# EasyEDA Pro project ProProject_AT_START_M412_V1.0.epro, schematic AT-START-M412-V1.0

## Sheets
1 AT-Link-EZ-V1.4: Board Name: AT-START-M412-V1.0; Create Date: 2024-06-20; Page Name: AT-Link-EZ-V1.4; Project Name: AT-START-M412; Schematic Name: AT-START-M412-V1.0; Update Date: 2024-08-05
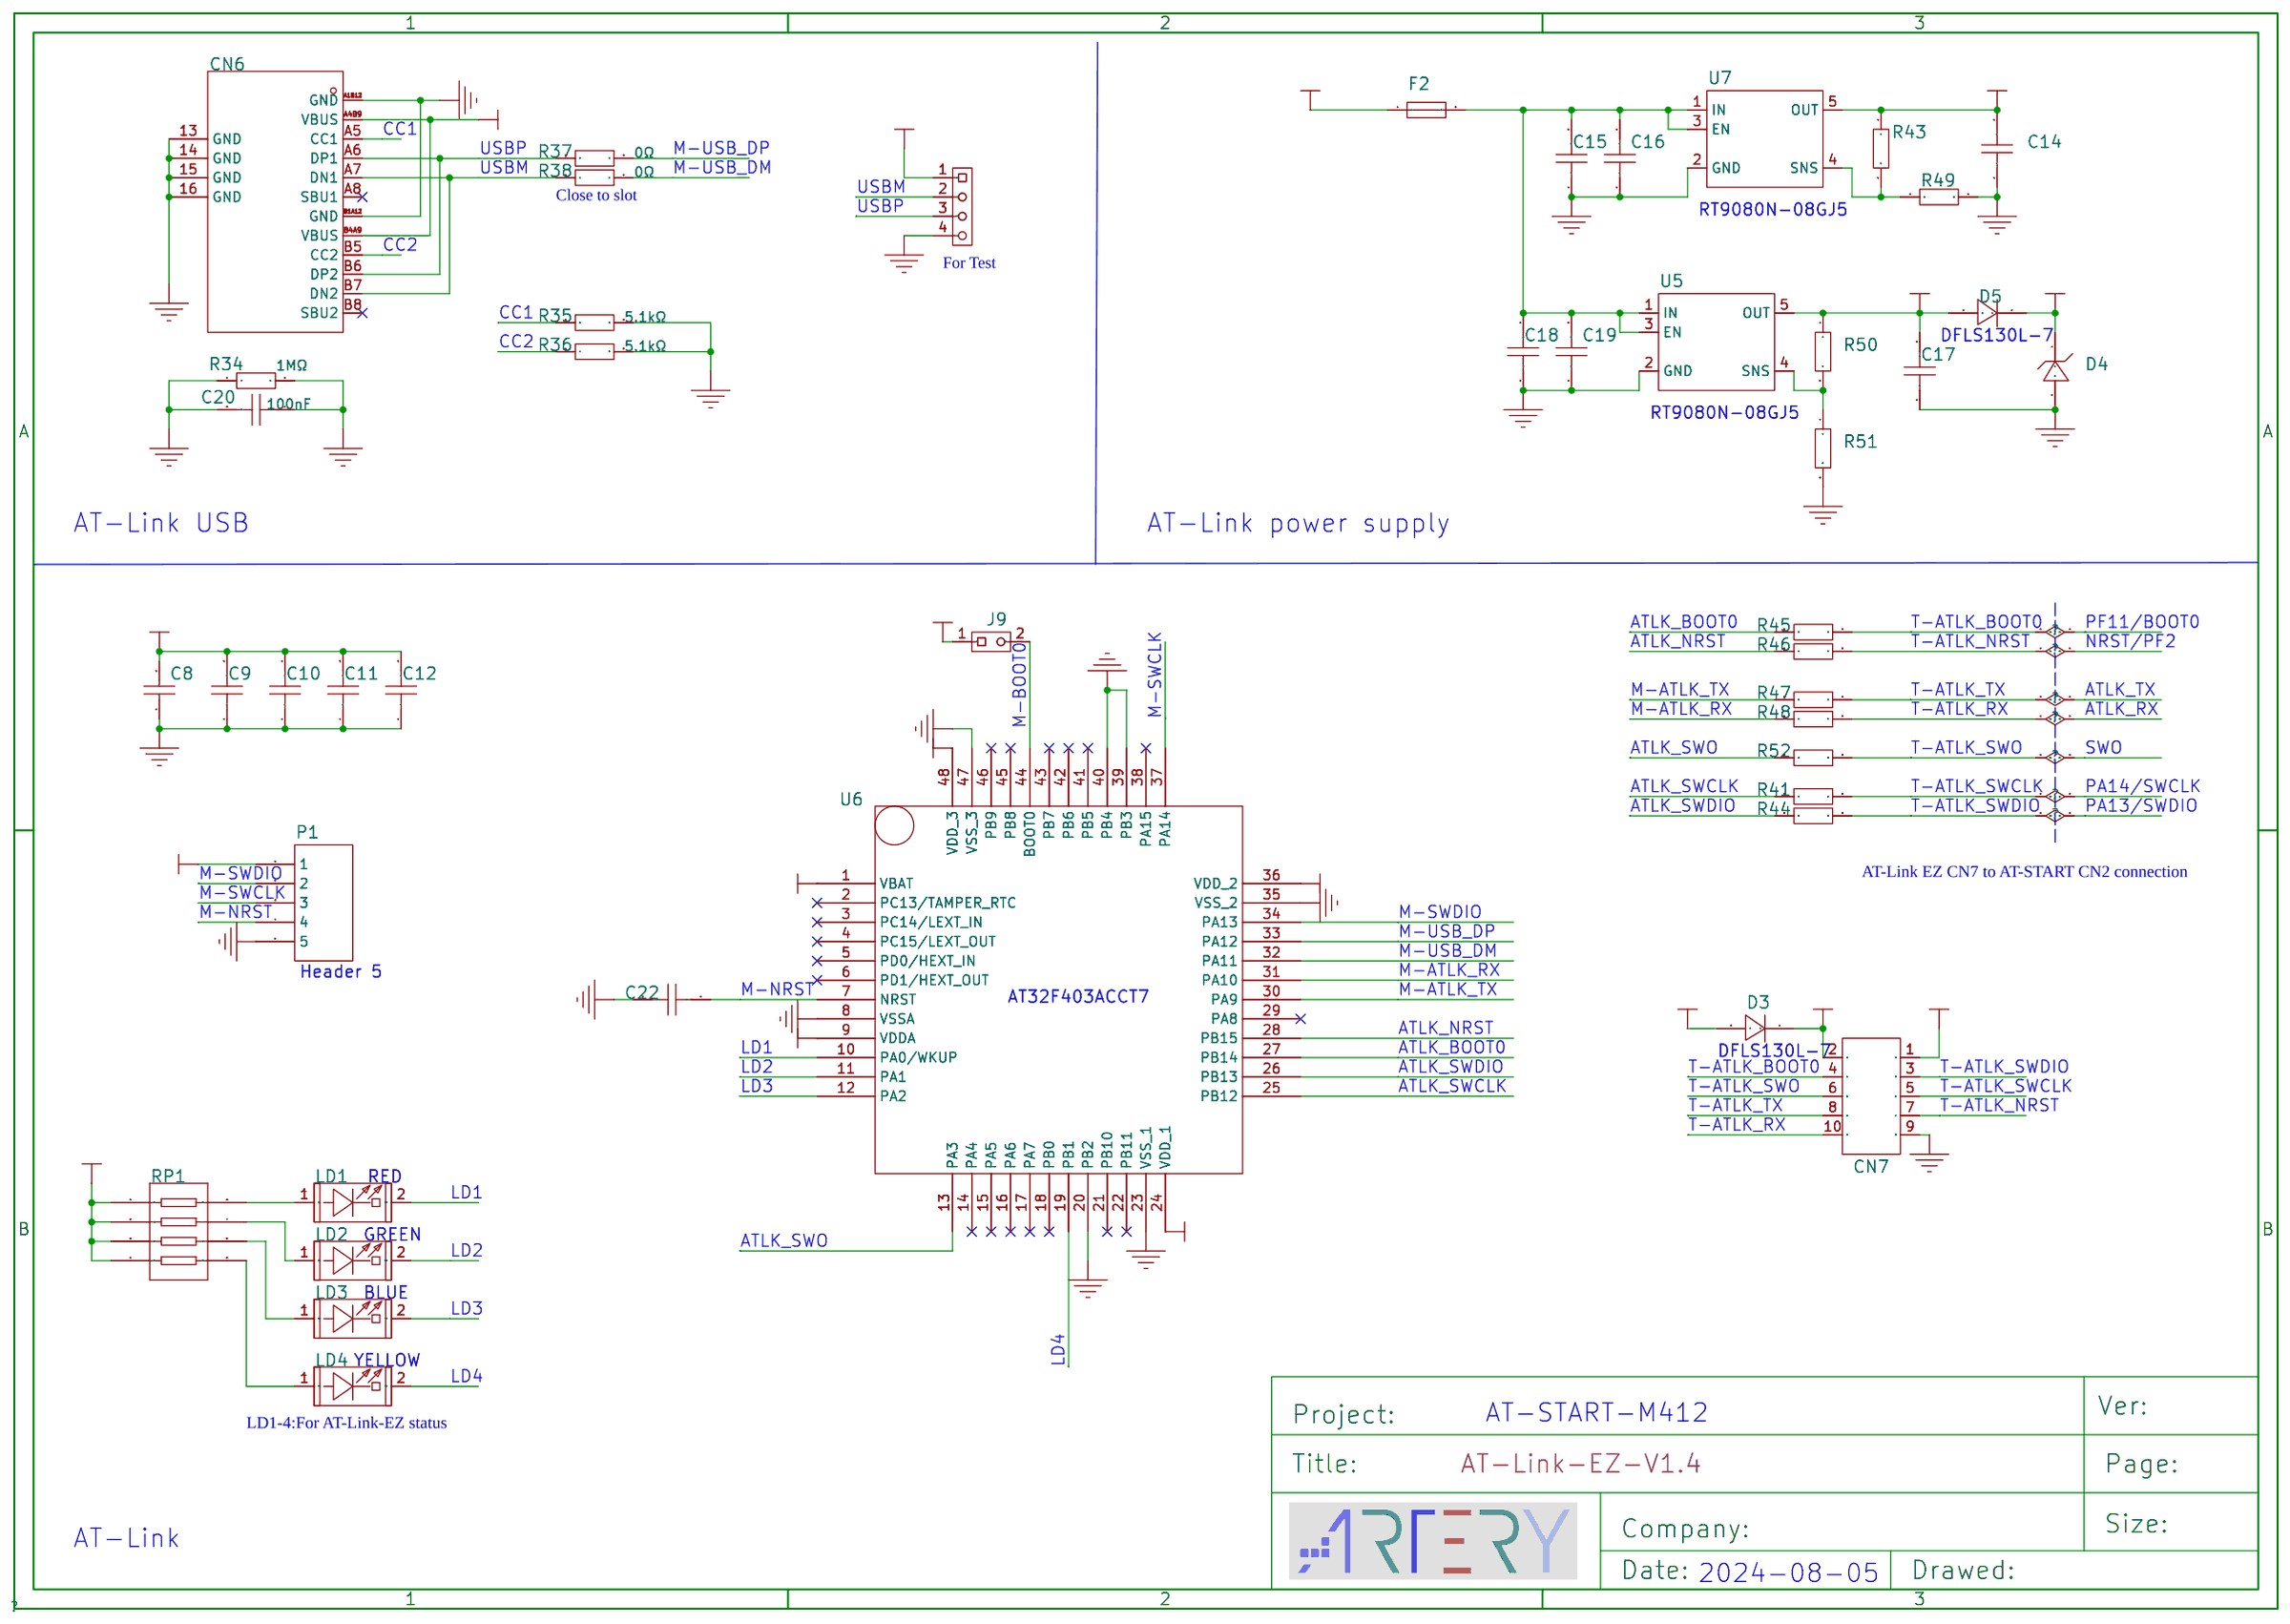
[diagram p0: AT-Link-EZ-V1.4]
2 MCU: Page Name: MCU; Update Date: 2024-08-06
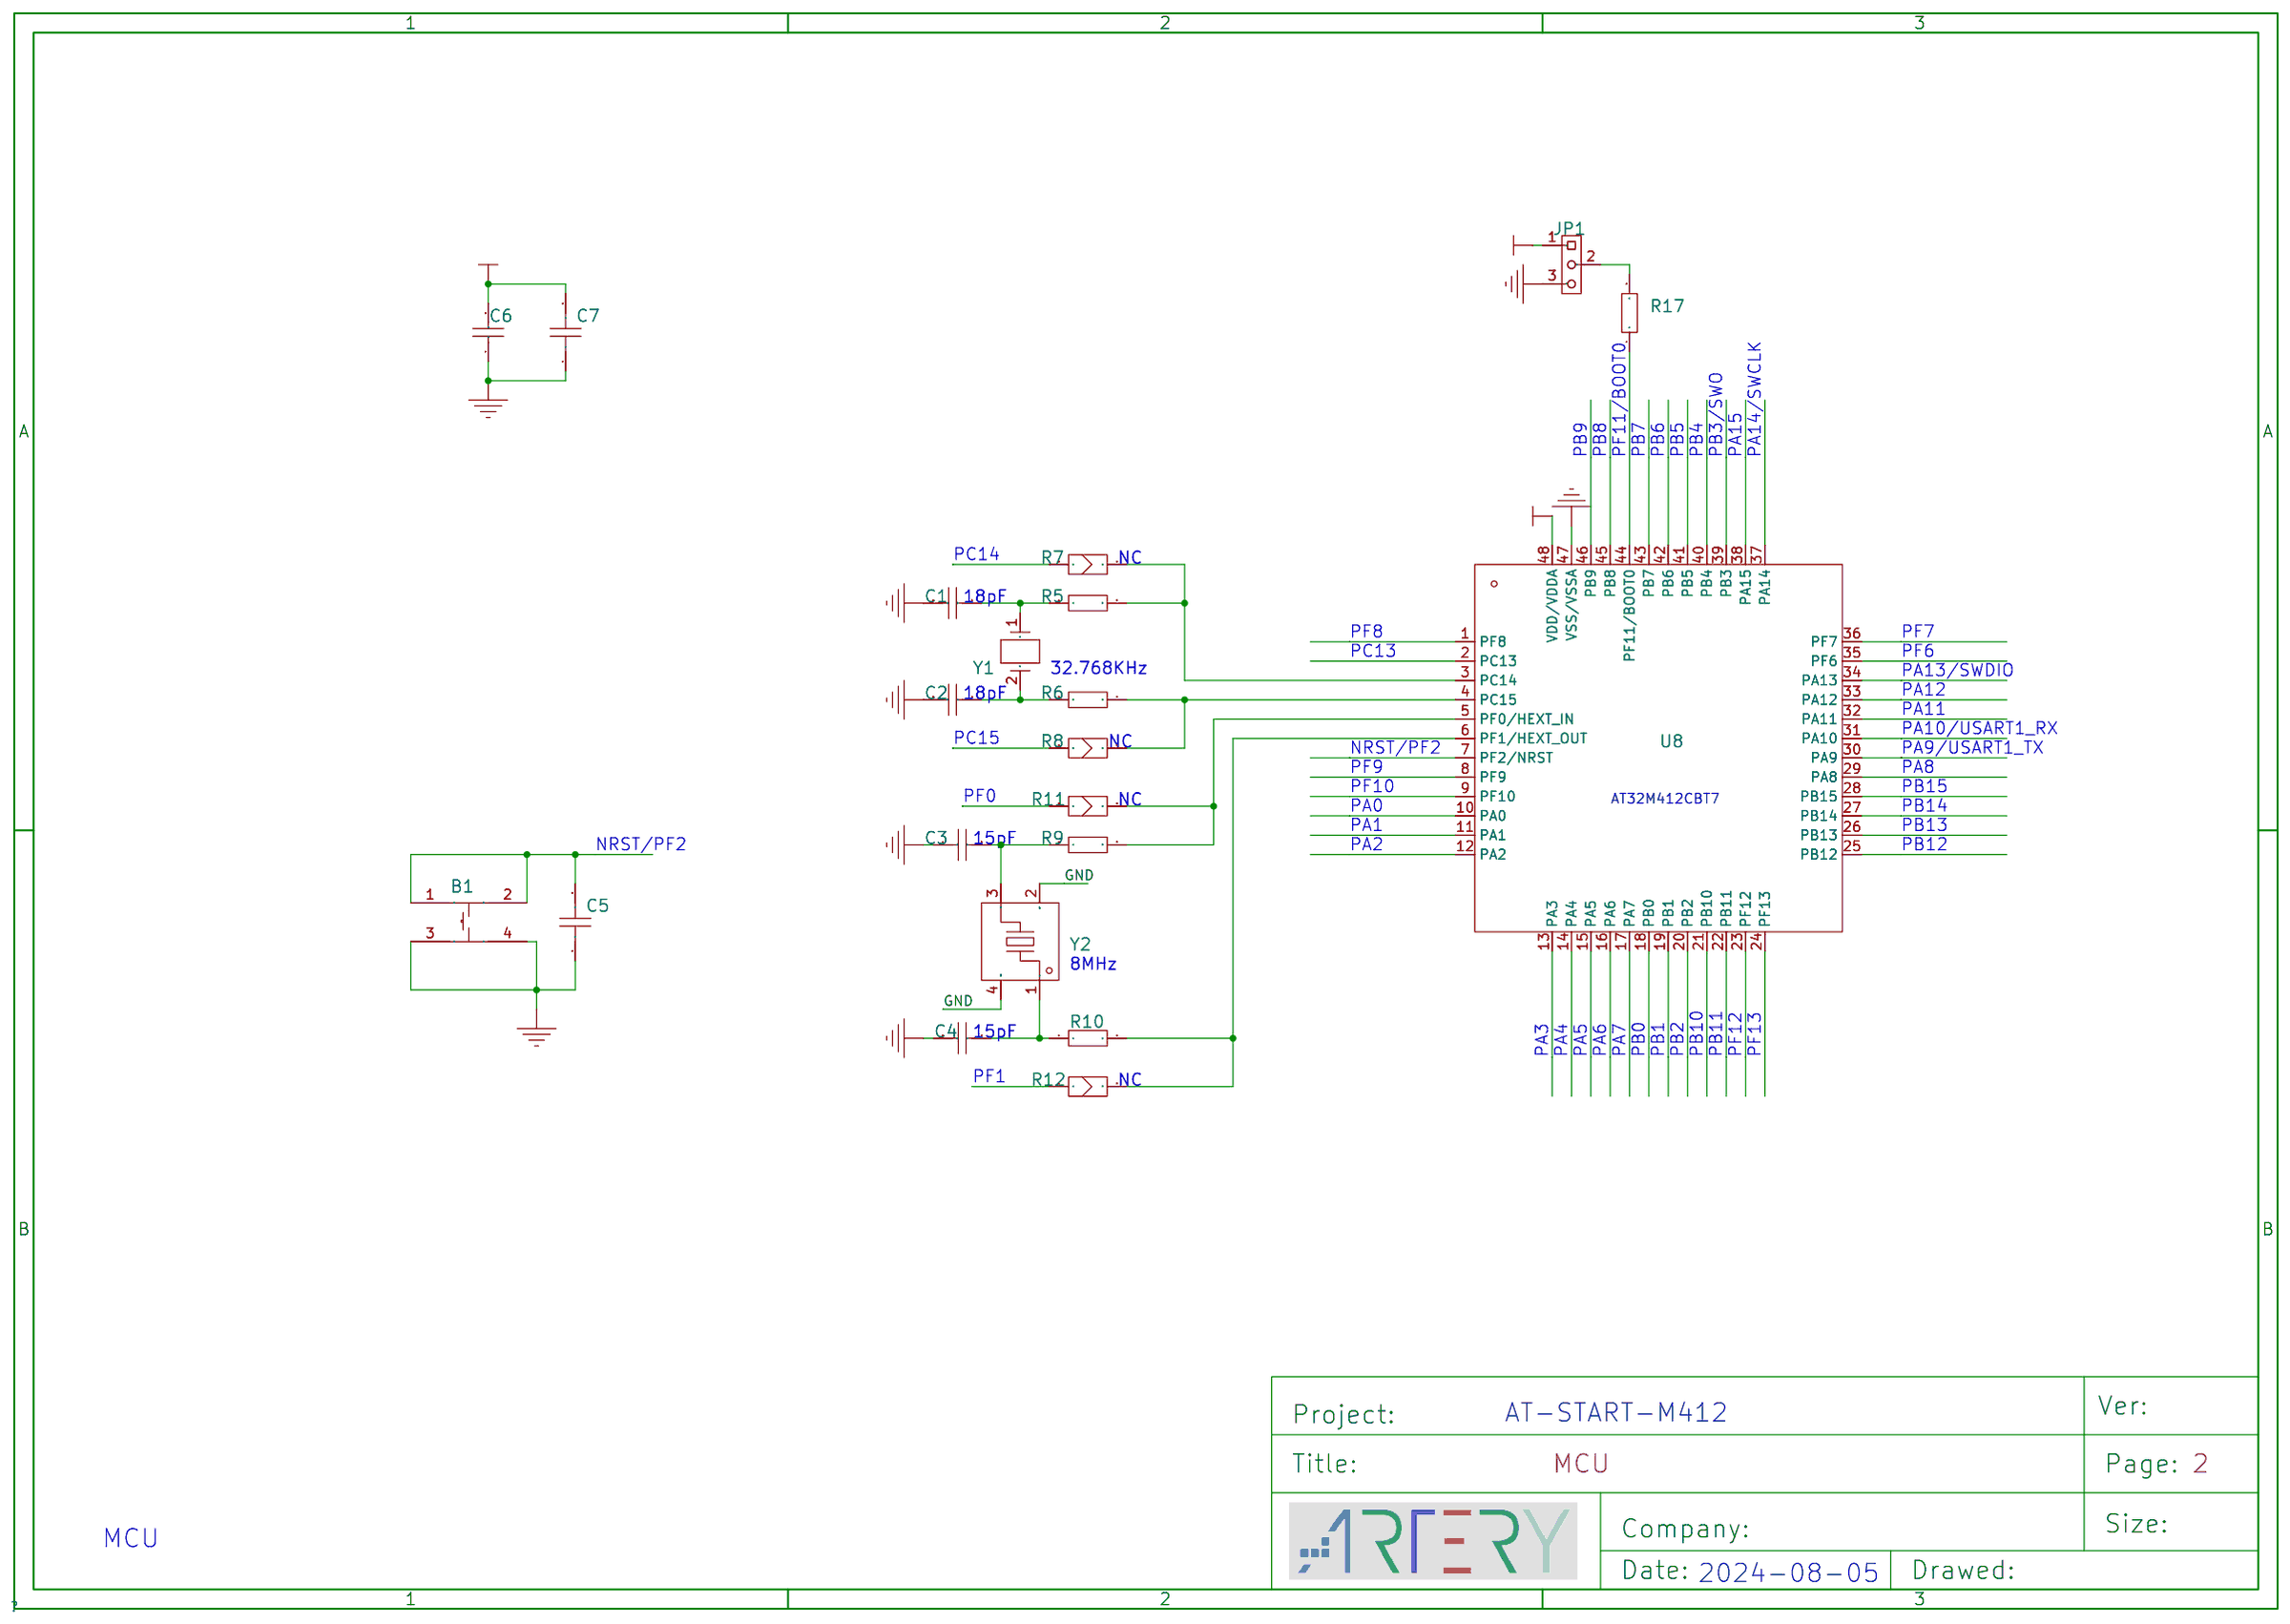
[diagram p1: MCU]
3 Power &amp; Peripherals: Page Name: Power &amp; Peripherals; Update Date: 2024-09-05
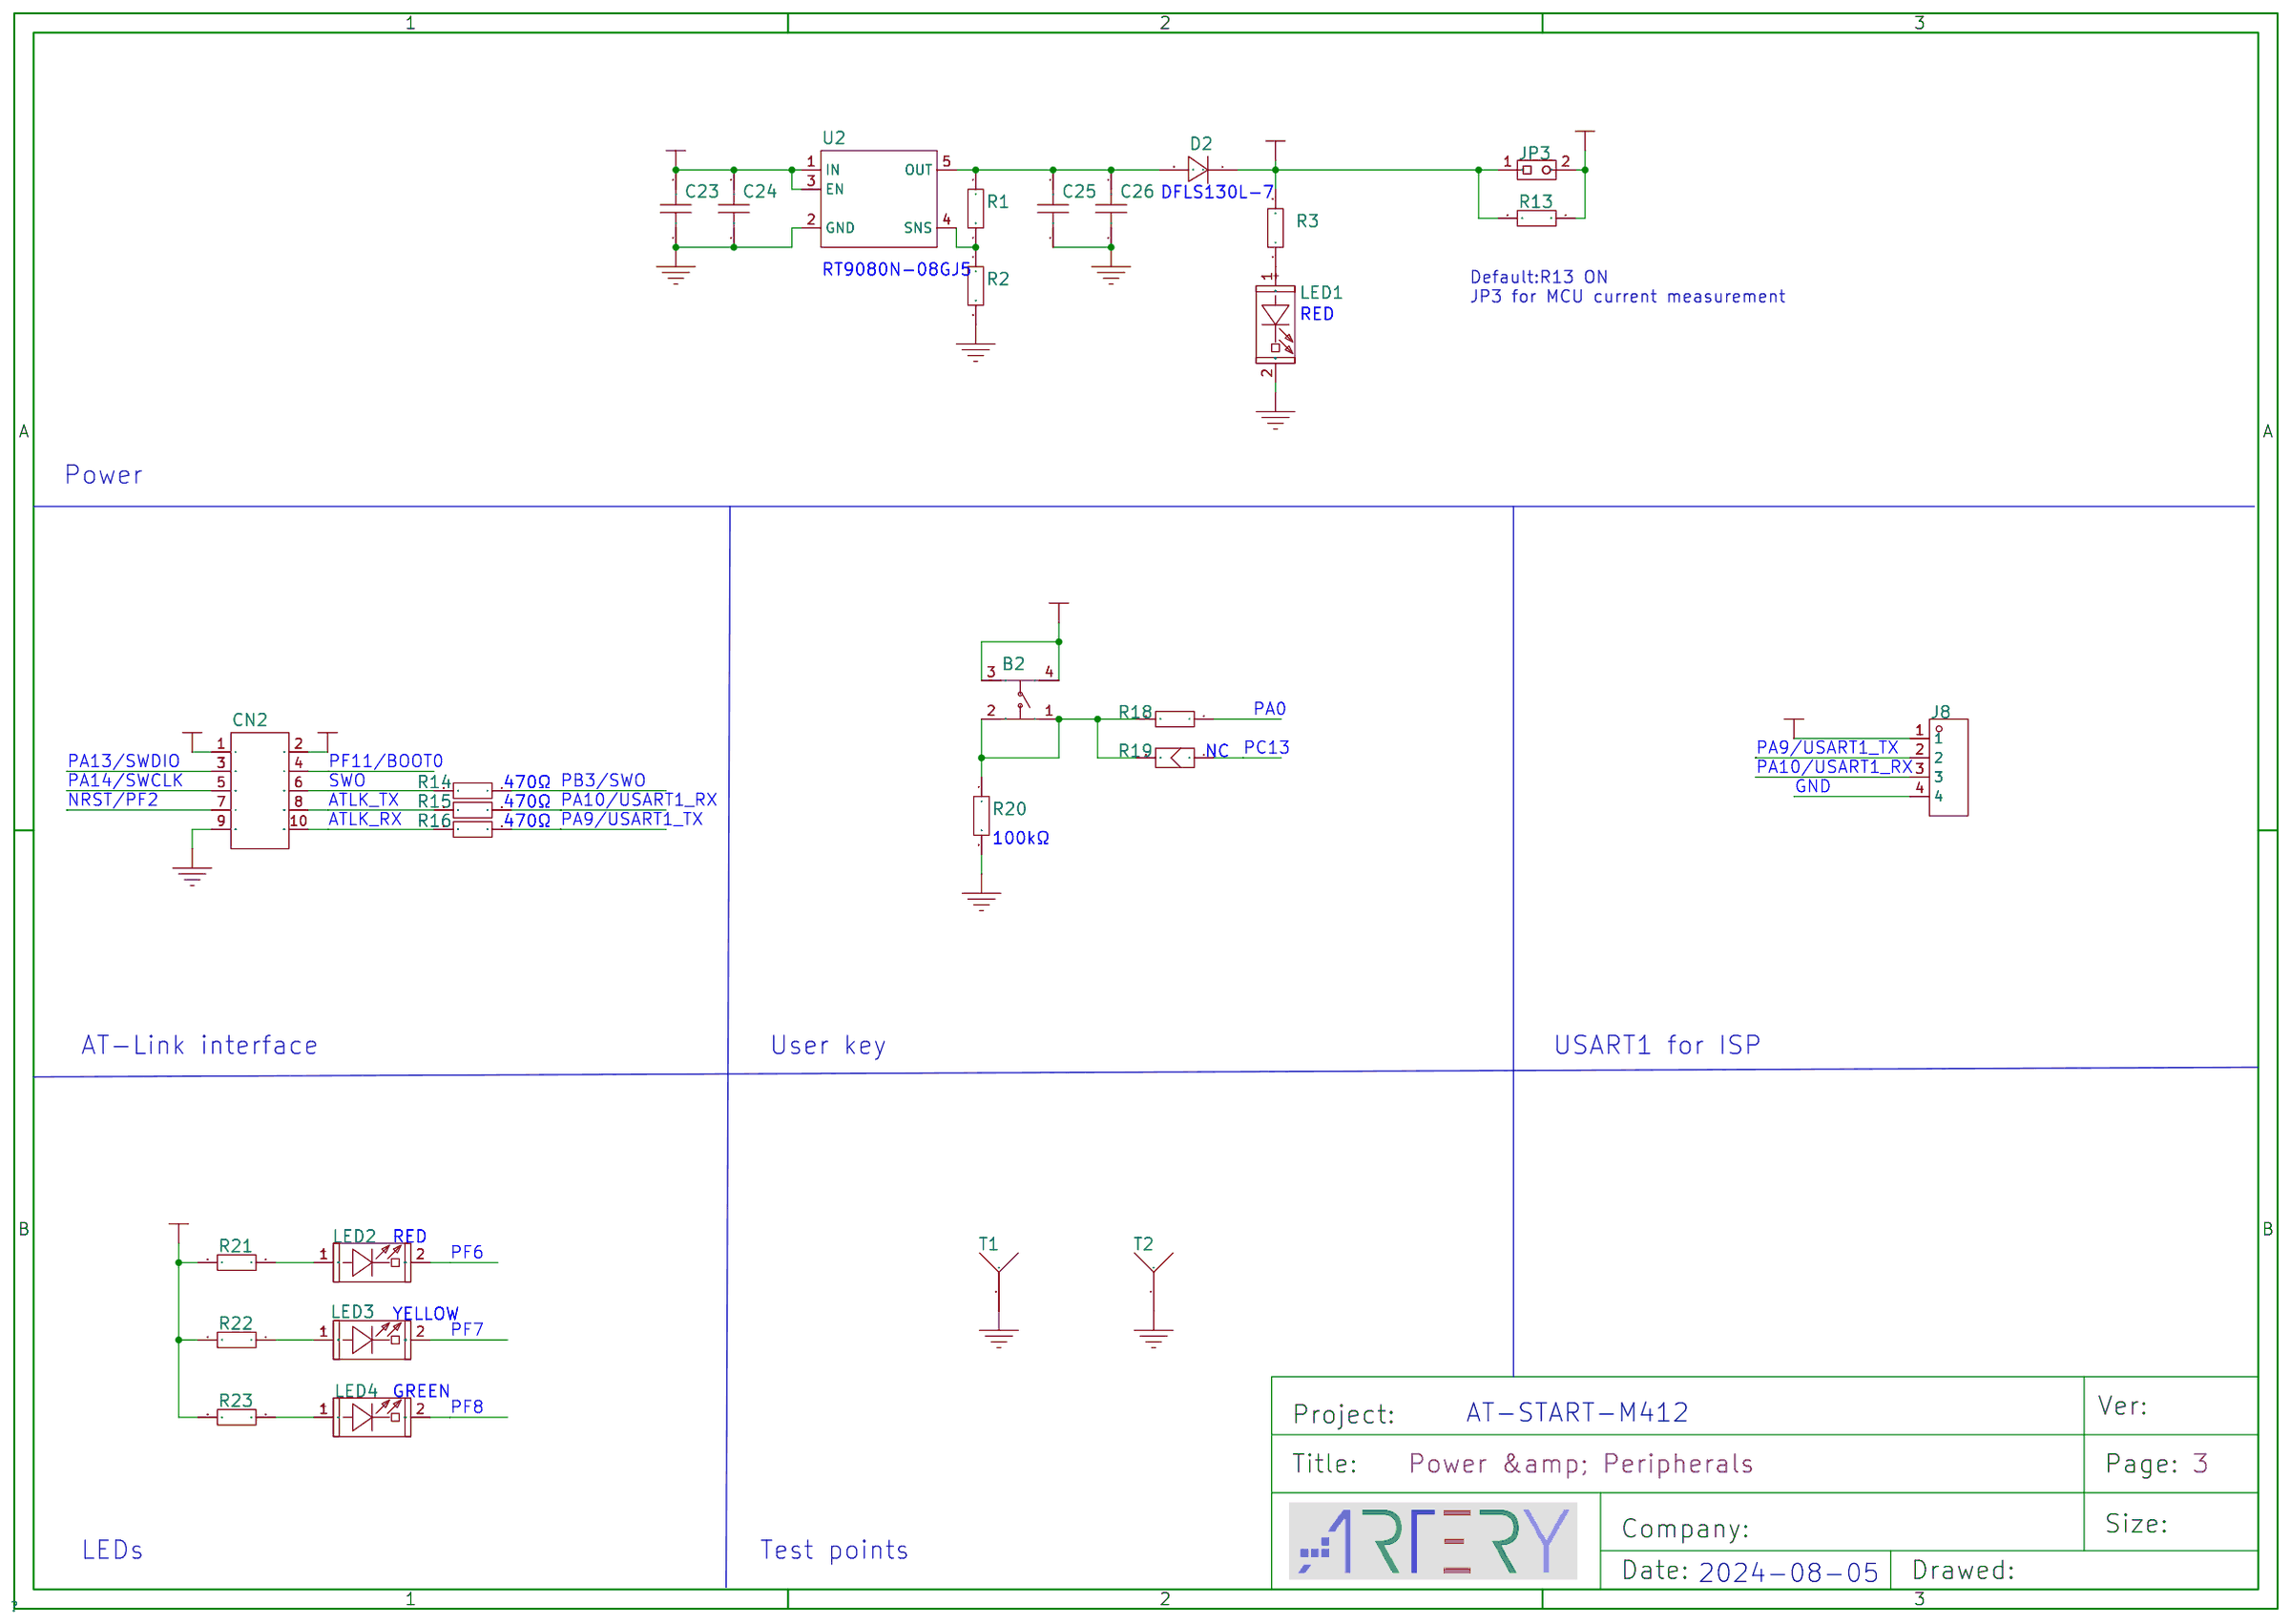
[diagram p2: Power &amp; Peripherals]
4 Connectors: Page Name: Connectors; Update Date: 2024-09-05
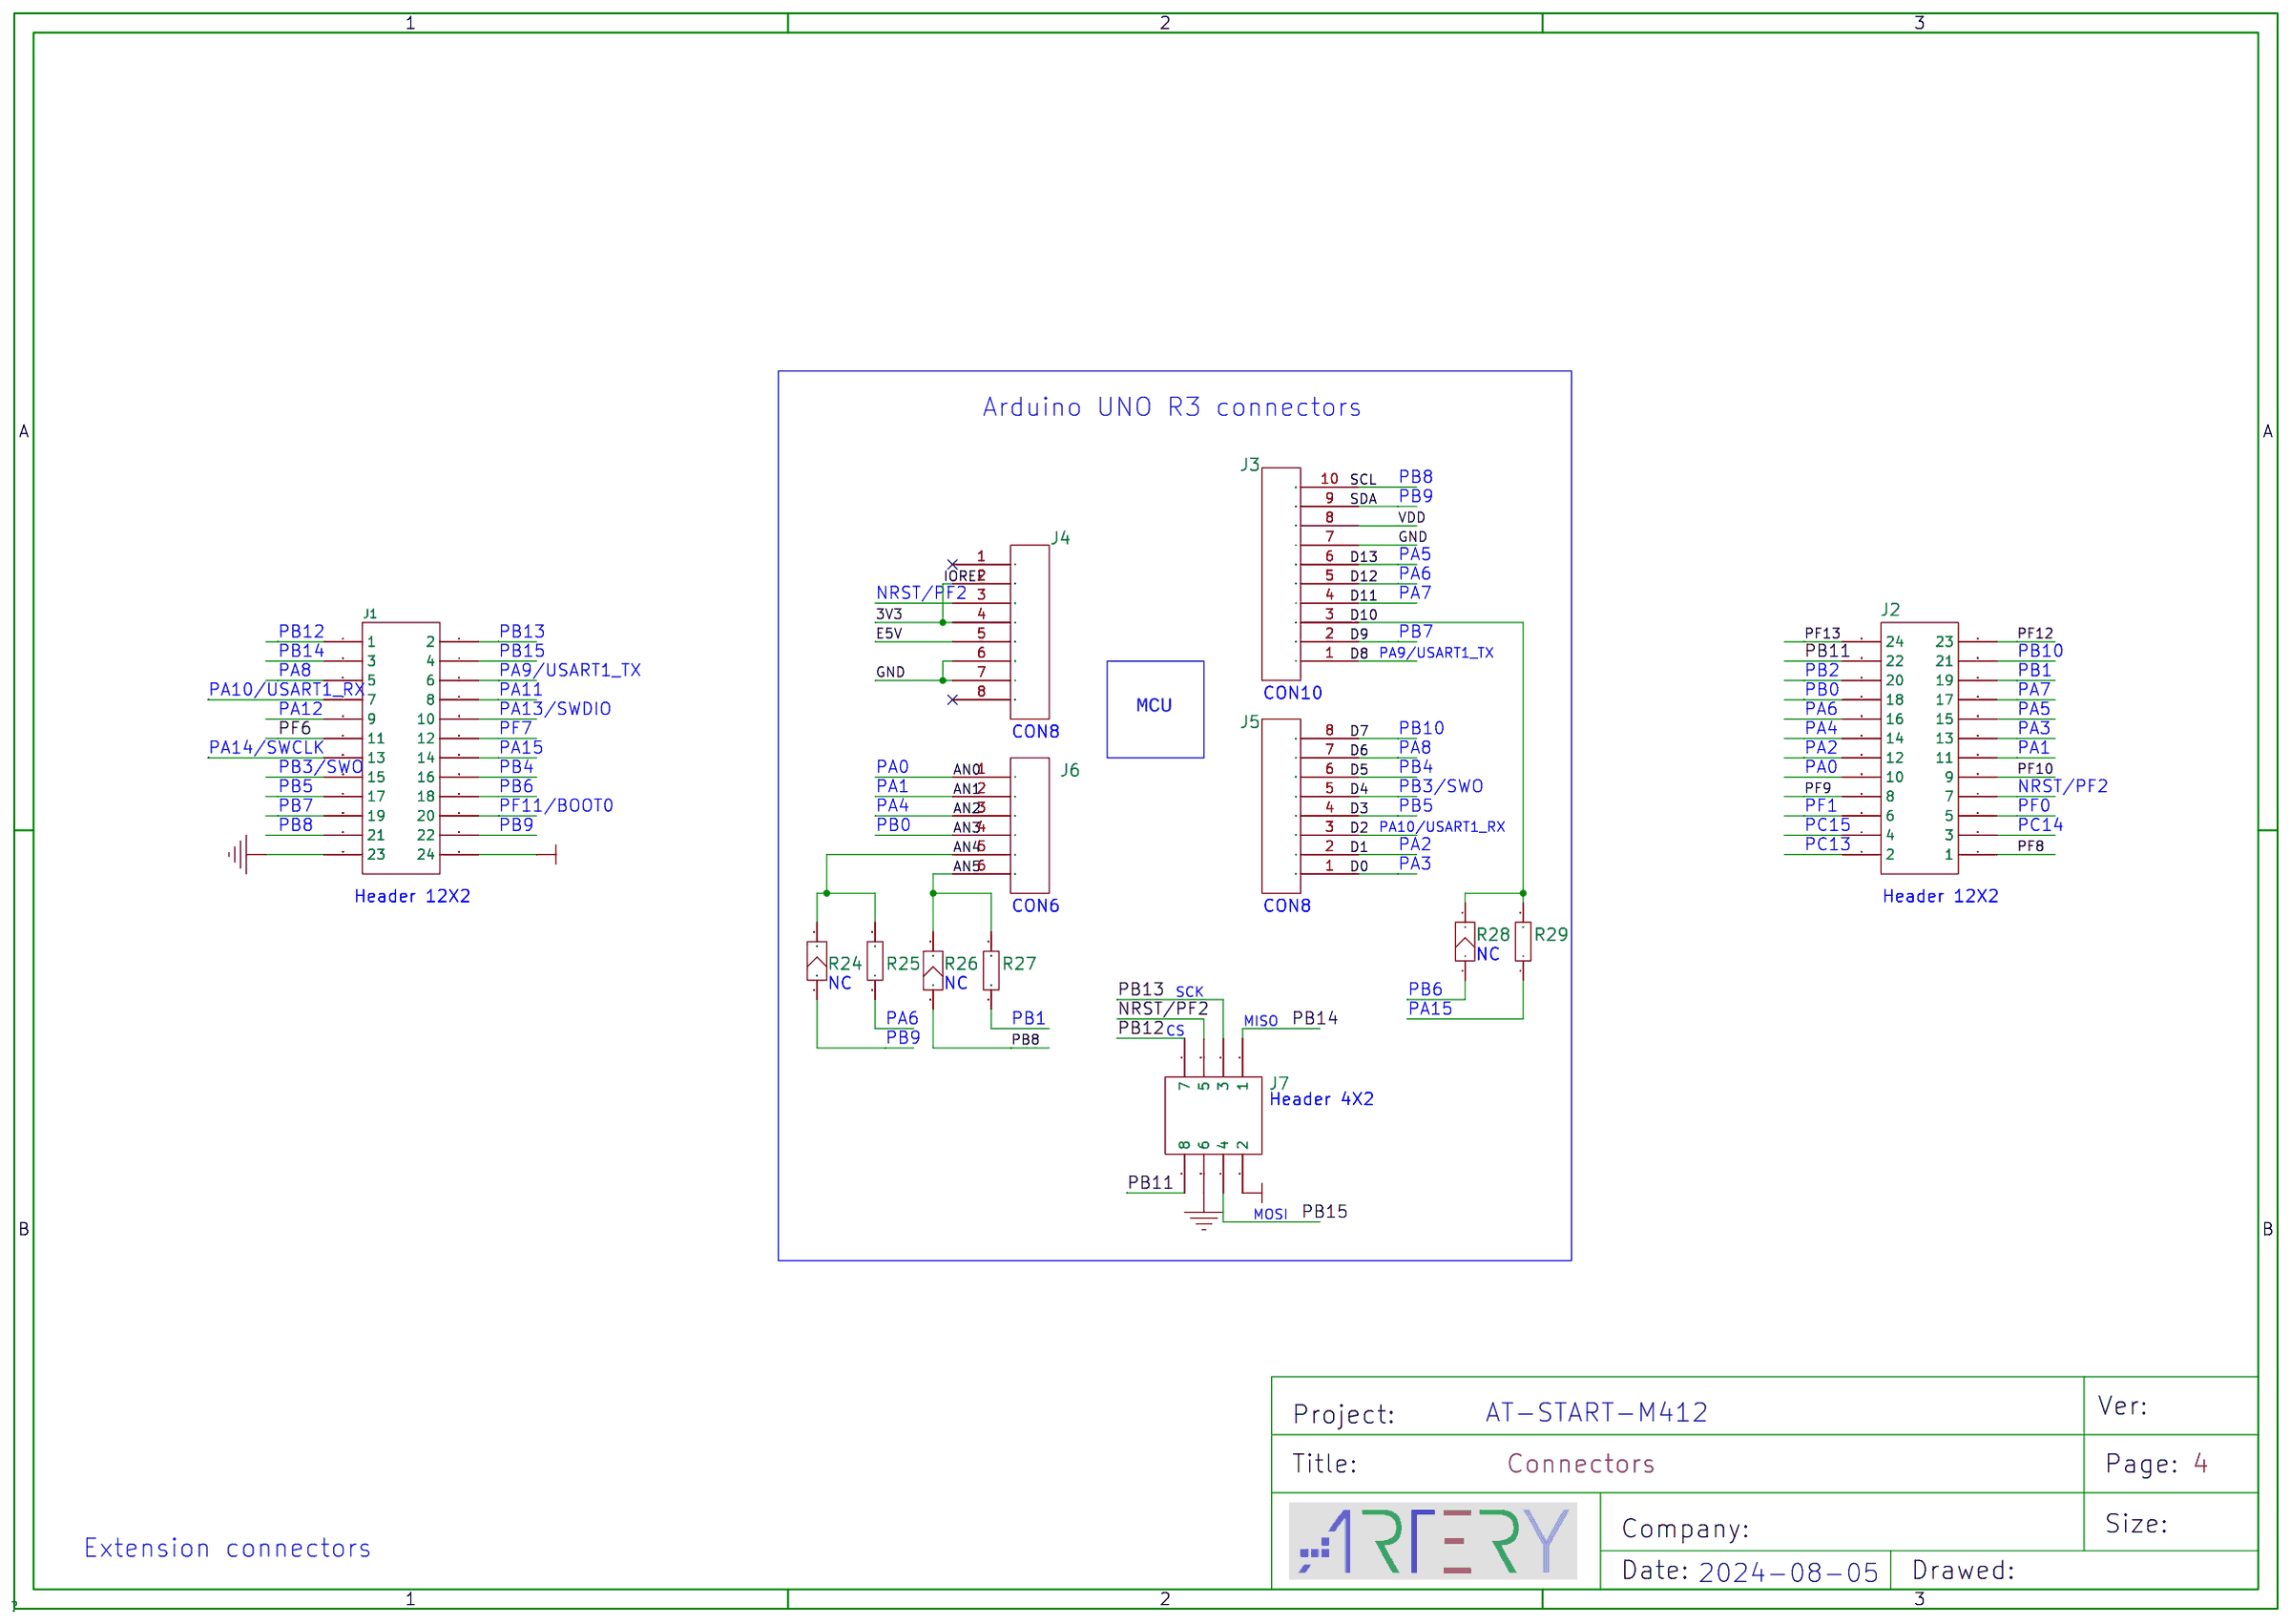
[diagram p3: Connectors]

## Parts
sheet AT-Link-EZ-V1.4
C8  4.7uF  [C0603]
C9  100nF  [C0603]
C10  100nF  [C0603]
C11  100nF  [C0603]
C12  100nF  [C0603]
C14  10uF  [C0603]
C15  10uF  [C0603]
C16  100nF  [C0603]
C17  10uF  [C0603]
C18  10uF  [C0603]
C19  100nF  [C0603]
C20  100nF  [C0603]
C22  100nF  [C0603]
CN6  -  [USB-C-SMD_TYPEC-304-BCP16]
CN7  CON10  [HDR2X5]
D3  DFLS130L-7  [POWERDI-123_L2.8-W1.8-LS3.7-RD]
D4  SMF3.3A  [SOD-123FL_L2.8-W1.8-LS3.8-RD]
D5  DFLS130L-7  [POWERDI-123_L2.8-W1.8-LS3.7-RD]
F2  BSMD0603-050-6V  [F0603]
J9  1X2P_2.54M  [HDR1X2]
LD1  RED  [LED0603]
LD2  GREEN  [LED0603]
LD3  BLUE  [LED0603]
LD4  YELLOW  [LED0603]
P1  Header 5  [HDR1X5]
R34  1MΩ  [R0603]
R35  5.1kΩ  [R0603]
R36  5.1kΩ  [R0603]
R37  0Ω  [R0603]
R38  0Ω  [R0603]
R41  33Ω  [R0603]
R43  47kΩ  [R0603]
R44  33Ω  [R0603]
R45  33Ω  [R0603]
R46  33Ω  [R0603]
R47  33Ω  [R0603]
R48  33Ω  [R0603]
R49  15kΩ  [R0603]
R50  51kΩ  [R0603]
R51  15kΩ  [R0603]
R52  33Ω  [R0603]
RP1  1kΩ  [RES-ARRAY-SMD_0603-8P-L3.2-W1.6-BL]
TP3  1X4P_2.54F  [HDR1X4 - TOP]
U5  RT9080N-08GJ5  [SOT-23-5]
U6  AT32F403ACCT7  [LQFP48 - 2]
U7  RT9080N-08GJ5  [SOT-23-5]
sheet Connectors
J1  Header 12X2  [HEAD2*12]
J2  Header 12X2  [HEAD2*12]
J3  CON10  [HDR1X10 - 2#]
J4  CON8  [HDR1X8 - 2#]
J5  CON8  [HDR1X8 - 2#]
J6  CON6  [HDR1X6 -2#]
J7  Header 4X2  [HDR2X4]
R24  NC  [SB-PAD_2]
R25  0Ω  [SB-PAD_2]
R26  NC  [SB-PAD_2]
R27  0Ω  [SB-PAD_2]
R28  NC  [SB-PAD_2]
R29  0Ω  [SB-PAD_2]
sheet MCU
B1  TS-1002S-05026C  [KEY-SMD_4P-L6.0-W6.0-P4.50-LS9.0]
C1  18pF  [C0603]
C2  18pF  [C0603]
C3  15pF  [C0603]
C4  15pF  [C0603]
C5  100nF  [C0603]
C6  4.7uF  [C0603]
C7  100nF  [C0603]
JP1  2.54-1*3P针  [HDR-TH_3P-P2.54-V-M-1]
R5  0Ω  [SB-PAD_2]
R6  0Ω  [SB-PAD_2]
R7  NC  [SB-PAD_2]
R8  NC  [SB-PAD_2]
R9  0Ω  [SB-PAD_2]
R10  0Ω  [SB-PAD_2]
R11  NC  [SB-PAD_2]
R12  NC  [SB-PAD_2]
R17  3.3kΩ  [R0603]
U8  -  [LQFP-48_L7.0-W7.0-P0.50-LS9.0-BL]
Y1  32.768KHz  [XTAL_SOP - FC-12M]
Y2  8MHz  [CRYSTAL-SMD_4P-L3.2-W2.5-BL]
sheet Power &amp; Peripherals
B2  TSA063G60-250  [KEY-SMD_4P-L6.1-W6.1-P4.50-LS9.0]
C23  10uF  [C0603]
C24  100nF  [C0603]
C25  10uF  [C0603]
C26  100nF  [C0603]
CN2  CON10  [HDR2X5]
D2  DFLS130L-7  [POWERDI-123_L2.8-W1.8-LS3.7-RD]
J8  PZ2.54-1*4-WZ  [HDR-TH_4P-P2.54-H-M-W7.7-P]
JP3  1X2P_2.54M  [HDR1X2]
LED1  RED  [LED0603]
LED2  RED  [LED0603]
LED3  YELLOW  [LED0603]
LED4  GREEN  [LED0603]
R1  51kΩ  [R0603]
R2  15kΩ  [R0603]
R3  1kΩ  [R0603]
R13  0Ω  [SB-PAD_2]
R14  470Ω  [R0603]
R15  470Ω  [R0603]
R16  470Ω  [R0603]
R18  0Ω  [SB-PAD_2]
R19  NC  [SB-PAD_2]
R20  100kΩ  [R0603]
R21  1kΩ  [R0603]
R22  1kΩ  [R0603]
R23  1kΩ  [R0603]
T1  Test point  [TestPoint]
T2  Test point  [TestPoint]
U2  RT9080N-08GJ5  [SOT-23-5]

## Library data of the parts
C8 = CL10A475KO8NNNC: 容值:4.7uF;精度:±10%;额定电压:16V;材质(温度系数):X5R;; LCSC Part Name: 4.7uF ±10% 16V; Supplier Part: C19666; Manufacturer: SAMSUNG(三星); Supplier Footprint: 0603; JLCPCB Part Class: Basic Part; Datasheet: https://atta.szlcsc.com/upload/public/pdf/source/20160218/1457707763339.pdf; Supplier: LCSC; Tolerance: ±10%; Voltage Rated: 16V; Temperature Coefficient: X5R; Design Item ID: Cap Semi; Library Name: PcbLib; Published: 8-Jun-2000; LatestRevisionDate: 29-May-2009; LatestRevisionNote: IPC-7351 Footprint Added.; PackageReference: C1206; Publisher: Altium Limited; PackageDescription: Chip Capacitor; Origin Footprint 2: 0603; Origin Footprint 3: 0402; Origin Footprint 4: C2512; Origin Footprint 5: 1608[0603]; Origin Footprint 6: C1210
C9-C12 = CC0603KRX7R9BB104: 容值:100nF;精度:±10%;额定电压:50V;材质(温度系数):X7R;; LCSC Part Name: 100nF ±10% 50V; Supplier Part: C14663; Manufacturer: YAGEO(国巨); Supplier Footprint: 0603; JLCPCB Part Class: Basic Part; Datasheet: https://atta.szlcsc.com/upload/public/pdf/source/20180910/C282072_33301C7F631E79921B82A8DAC6BCC5B3.pdf; Supplier: LCSC; Tolerance: ±10%; Voltage Rated: 50V; Temperature Coefficient: X7R; Design Item ID: Cap Semi; Library Name: PcbLib; Published: 8-Jun-2000; LatestRevisionDate: 29-May-2009; LatestRevisionNote: IPC-7351 Footprint Added.; PackageReference: C1206; Publisher: Altium Limited; PackageDescription: Chip Capacitor; Origin Footprint 2: 0603; Origin Footprint 3: 0402; Origin Footprint 4: C2512; Origin Footprint 5: 1608[0603]; Origin Footprint 6: C1210
C14 C15 C17 C18 = CL10A106KP8NNNC: 容值:10uF;精度:±10%;额定电压:10V;材质(温度系数):X5R;; LCSC Part Name: 10uF ±10% 10V; Supplier Part: C19702; Manufacturer: SAMSUNG(三星); Supplier Footprint: 0603; JLCPCB Part Class: Basic Part; Datasheet: https://atta.szlcsc.com/upload/public/pdf/source/20160218/1457707763339.pdf; Supplier: LCSC; Tolerance: ±10%; Voltage Rated: 10V; Temperature Coefficient: X5R; Design Item ID: 0.1uF,50V,20%,SMD0603; Library Name: *
C5 C16 C19 C22 = CC0603KRX7R9BB104: 容值:100nF;精度:±10%;额定电压:50V;材质(温度系数):X7R;; LCSC Part Name: 100nF ±10% 50V; Supplier Part: C14663; Manufacturer: YAGEO(国巨); Supplier Footprint: 0603; JLCPCB Part Class: Basic Part; Datasheet: https://atta.szlcsc.com/upload/public/pdf/source/20180910/C282072_33301C7F631E79921B82A8DAC6BCC5B3.pdf; Supplier: LCSC; Tolerance: ±10%; Voltage Rated: 50V; Temperature Coefficient: X7R; Design Item ID: 0.1uF,50V,20%,SMD0603; Library Name: *
C20 = CC0603KRX7R9BB104: 容值:100nF;精度:±10%;额定电压:50V;温度系数:X7R;; LCSC Part Name: 100nF ±10% 50V; Supplier Part: C14663; Manufacturer: YAGEO(国巨); Supplier Footprint: 0603; JLCPCB Part Class: Basic Part; Datasheet: https://atta.szlcsc.com/upload/public/pdf/source/20170116/1484561234239.pdf; Supplier: LCSC; Tolerance: ±10%; Voltage Rated: 50V; Temperature Coefficient: X7R
CN6 = TYPEC-304-BCP16: 连接器类型:Type-C;标准:USB 3.1;公母:母座;触点数量:16.0;端口数量:1;安装方式:卧贴;额定电流 - 电源:3A;工作温度范围:-25~+85;焊接温度(最大值):260;; Supplier Part: C720629; Manufacturer: XUNPU(讯普); Supplier Footprint: SMD; JLCPCB Part Class: Extended Part; Datasheet: https://atta.szlcsc.com/upload/public/pdf/source/20211022/DACD6552F639E9483017DE6DC0E61150.pdf; Supplier: LCSC; Connector Type: Type-C; Standard: USB 3.1; Gender: 母座; Number of Contacts: 16.0; Number of Ports: 1; Mounting Sytle: 卧贴; Current Rating - Power (Max): 3A; Operating Temperature Range: -25~+85; Welding Temperature (Max): 260
CN7 = CON10: 简易牛角DC3-10P 双排90度弯插针 2.54mm 2*5P双排 黑色; Design Item ID: CON10A_0; Library Name: *
D2 D3 D5 = DFLS130L-7: 正向压降(Vf):310mV@1A;直流反向耐压(Vr):30V;平均整流电流(Io):1A;; LCSC Part Name: 电压:30V 电流:1A; Supplier Part: C110493; Manufacturer: DIODES(美台); Supplier Footprint: Power-DI-123; JLCPCB Part Class: Extended Part; Datasheet: https://atta.szlcsc.com/upload/public/pdf/source/20170427/1493286393645.pdf; Supplier: LCSC; Forward Voltage (Vf@If): 310mV@1A; Reverse Voltage (Vr): 30V; Average Rectified Current (Io): 1A; Design Item ID: Diode; Library Name: Miscellaneous Devices; Published: 8-Jun-2000; LatestRevisionDate: 17-Jul-2002; LatestRevisionNote: Re-released for DXP Platform.; PackageVersion: Sep-1996; PackageReference: SMC; Publisher: Altium Limited; PackageDescription: DO-214-AB/SMC; 2 C-Bend Leads; Body 7.9 x 5.9 mm, inc. leads (LxW); Code_JEDEC: DO-214-AB
D4 = SMF3.3A_C2759873: 反向截止电压(Vrwm):3.3V;最大钳位电压:7.3V;峰值脉冲电流(Ipp)@10/1000us:27.5A;击穿电压:4.1V;; Supplier Part: C2759873; Manufacturer: Leiditech(雷卯电子); Supplier Footprint: SOD-123FL; JLCPCB Part Class: Extended Part; Datasheet: https://atta.szlcsc.com/upload/public/pdf/source/20210330/C2759873_54039300A94B4A929A30F4E6BEAFC556.pdf; Supplier: LCSC; Reverse Stand-Off Voltage (Vrwm): 3.3V; Maximum Clamping Voltage: 7.3V; Peak Pulse Current (Ipp)@10/1000us: 27.5A; Breakdown Voltage: 4.1V; Reverse Leakage Current (Ir): 500uA; Type: TVS; Design Item ID: Diode; Library Name: Miscellaneous Devices; Published: 8-Jun-2000; LatestRevisionDate: 17-Jul-2002; LatestRevisionNote: Re-released for DXP Platform.; PackageVersion: Sep-1996; PackageReference: SMC; Publisher: Altium Limited; PackageDescription: DO-214-AB/SMC; 2 C-Bend Leads; Body 7.9 x 5.9 mm, inc. leads (LxW); Code_JEDEC: DO-214-AB
F2 = BSMD0603-050-6V: 最大电压:6V;最大电流:40A;保持电流:500mA;跳闸电流:1A;; LCSC Part Name: 6V 500mA 0603自恢复; Supplier Part: C883095; Manufacturer: BHFUSE(佰宏); Supplier Footprint: 0603; JLCPCB Part Class: Extended Part; Datasheet: https://atta.szlcsc.com/upload/public/pdf/source/20230512/E478DE3555A0061DA0124A9F45802B86.pdf; Supplier: LCSC; Operating Voltage (Max): 6V; Current Rating (Max): 40A; Hold Current: 500mA; Trip Current: 1A; Power Dissipation: 500mW; Resistance - Initial (Ri) (Min): 100mΩ; Resistance - Post Trip (R1) (Max): 800mΩ; Maximum Time to Trip: 100ms; Operating Temperature: -40℃~+85℃; Design Item ID: Fuse 1; Library Name: Miscellaneous Devices; Published: 8-Jun-2000; LatestRevisionDate: 17-Jul-2002; LatestRevisionNote: Re-released for DXP Platform.; PackageReference: PIN-W2/E2.8; Publisher: Altium Limited; PackageDescription: Thru-Hole; 2 Leads
J9 = 1X2P_2.54M: 单排直插针1*2P 2.54mm（黑色）; Origin Footprint 2: SIP_2P; Design Item ID: 1X2P,Male,DIP_2.54; Library Name: *; Check: true
LD1 LED1 LED2 = RED: 贴片LED 红色  0603; Design Item ID: RED,SMD0603; Library Name: AT32F403_TINY_LQFP144_Library
LD2 LED4 = GREEN: 贴片LED 绿色 0603; Design Item ID: GREEN,SMD0603; Library Name: AT32F403_TINY_LQFP144_Library
LD3 = BLUE: 贴片LED 蓝色 0603; Design Item ID: BLUE,SMD0603; Library Name: AT_START_F415
LD4 LED3 = YELLOW: 贴片LED 黄色 0603; Design Item ID: YELLOW,SMD0603; Library Name: Schlib1
P1 = Header 5: 单排直插针1*5P 2.54mm （黑色）; LatestRevisionDate: 17-Jul-2002; LatestRevisionNote: Re-released for DXP Platform.; Publisher: Altium Limited; Library Name: Miscellaneous Connectors
R34 = RC0603FR-071ML: 阻值:1MΩ;精度:±1%;功率:100mW;温度系数:±100ppm/;最大工作电压:75V;工作温度范围:-55~+155;; LCSC Part Name: 1MΩ ±1%; Supplier Part: C105578; Manufacturer: YAGEO(国巨); Supplier Footprint: 0603; JLCPCB Part Class: Extended Part; Datasheet: https://atta.szlcsc.com/upload/public/pdf/source/20181102/C105578_67A9388250AF143DE4682E62257D2969.pdf; Supplier: LCSC; Tolerance: ±1%; Power(Watts): 100mW; Temperature Coefficient: ±100ppm/; Overload Voltage (Max): 75V; Operating Temperature Range: -55~+155
R35 R36 = 0603WAF5101T5E: 电阻类型:厚膜电阻;阻值:5.1kΩ;精度:±1%;功率:1/10W;温度系数:±100ppm/;最大工作电压:75V;工作温度范围:-55~+155;; LCSC Part Name: 5.1kΩ ±1%; Supplier Part: C23186; Manufacturer: UNI-ROYAL(厚声); Supplier Footprint: 0603; JLCPCB Part Class: Basic Part; Datasheet: https://atta.szlcsc.com/upload/public/pdf/source/20200306/C422600_1E6D84923E4A46A82E41ADD87F860B5C.pdf; Supplier: LCSC; Type: 厚膜电阻; Tolerance: ±1%; Power(Watts): 1/10W; Temperature Coefficient: ±100ppm/; Overload Voltage (Max): 75V; Operating Temperature Range: -55~+155
R37 R38 = 0603WAF0000T5E: 电阻类型:厚膜电阻;阻值:0Ω;精度:±1%;功率:1/10W;温度系数:-;最大工作电压:75V;工作温度范围:-55~+155;; LCSC Part Name: 0Ω ±1%; Supplier Part: C21189; Manufacturer: UNI-ROYAL(厚声); Supplier Footprint: 0603; JLCPCB Part Class: Basic Part; Datasheet: https://atta.szlcsc.com/upload/public/pdf/source/20200306/C422600_1E6D84923E4A46A82E41ADD87F860B5C.pdf; Supplier: LCSC; Type: 厚膜电阻; Tolerance: ±1%; Power(Watts): 1/10W; Overload Voltage (Max): 75V; Operating Temperature Range: -55~+155
R41 R44-R48 R52 = 0603WAF330JT5E: 电阻类型:厚膜电阻;阻值:33Ω;精度:±1%;功率:100mW;最大工作电压:75V;温度系数:±100ppm/℃;; LCSC Part Name: 33Ω ±1% 100mW 厚膜电阻; Supplier Part: C23140; Manufacturer: UNI-ROYAL(厚声); Supplier Footprint: 0603; JLCPCB Part Class: Basic Part; Datasheet: https://atta.szlcsc.com/upload/public/pdf/source/20200306/C422600_1E6D84923E4A46A82E41ADD87F860B5C.pdf; Supplier: LCSC; Type: 厚膜电阻; Tolerance: ±1%; Power(Watts): 100mW; Overload Voltage (Max): 75V; Temperature Coefficient: ±100ppm/℃; Operating Temperature Range: -55℃~+155℃; Design Item ID: 22,1/10W,1%,SMD0603; Library Name: *
R43 = 0603WAF4702T5E: 电阻类型:厚膜电阻;阻值:47kΩ;精度:±1%;功率:100mW;最大工作电压:75V;温度系数:±100ppm/℃;; LCSC Part Name: 47kΩ ±1% 100mW 厚膜电阻; Supplier Part: C25819; Manufacturer: UNI-ROYAL(厚声); Supplier Footprint: 0603; JLCPCB Part Class: Basic Part; Datasheet: https://atta.szlcsc.com/upload/public/pdf/source/20200306/C422600_1E6D84923E4A46A82E41ADD87F860B5C.pdf; Supplier: LCSC; Type: 厚膜电阻; Tolerance: ±1%; Power(Watts): 100mW; Overload Voltage (Max): 75V; Temperature Coefficient: ±100ppm/℃; Operating Temperature Range: -55℃~+155℃; Design Item ID: 470,1/10W,1%,SMD0603; Library Name: *
R2 R49 R51 = 0603WAF1502T5E: 电阻类型:厚膜电阻;阻值:15kΩ;精度:±1%;功率:100mW;最大工作电压:75V;温度系数:±100ppm/℃;; LCSC Part Name: 15kΩ ±1% 100mW 厚膜电阻; Supplier Part: C22809; Manufacturer: UNI-ROYAL(厚声); Supplier Footprint: 0603; JLCPCB Part Class: Basic Part; Datasheet: https://atta.szlcsc.com/upload/public/pdf/source/20200306/C422600_1E6D84923E4A46A82E41ADD87F860B5C.pdf; Supplier: LCSC; Type: 厚膜电阻; Tolerance: ±1%; Power(Watts): 100mW; Overload Voltage (Max): 75V; Temperature Coefficient: ±100ppm/℃; Operating Temperature Range: -55℃~+155℃; Design Item ID: 470,1/10W,1%,SMD0603; Library Name: *
R1 R50 = 0603WAF5102T5E: 电阻类型:厚膜电阻;阻值:51kΩ;精度:±1%;功率:100mW;最大工作电压:75V;温度系数:±100ppm/℃;; LCSC Part Name: 51kΩ ±1% 100mW 厚膜电阻; Supplier Part: C23196; Manufacturer: UNI-ROYAL(厚声); Supplier Footprint: 0603; JLCPCB Part Class: Basic Part; Datasheet: https://atta.szlcsc.com/upload/public/pdf/source/20200306/C422600_1E6D84923E4A46A82E41ADD87F860B5C.pdf; Supplier: LCSC; Type: 厚膜电阻; Tolerance: ±1%; Power(Watts): 100mW; Overload Voltage (Max): 75V; Temperature Coefficient: ±100ppm/℃; Operating Temperature Range: -55℃~+155℃; Design Item ID: 470,1/10W,1%,SMD0603; Library Name: *
RP1 = 4D03WGJ0102T5E: 电阻器数:4;阻值:1kΩ;精度:±5%;单个元件功率:62.5mW;温度系数:±200ppm/℃;; LCSC Part Name: 1kΩ ±5%; Supplier Part: C20197; Manufacturer: UNI-ROYAL(厚声); Supplier Footprint: 0603x4; JLCPCB Part Class: Basic Part; Datasheet: https://atta.szlcsc.com/upload/public/pdf/source/20191224/C474318_2527498AE30E813171187CCD28401A71.pdf; Supplier: LCSC; Number of Resistors: 4; Tolerance: ±5%; Power(Watts): 62.5mW; Temperature Coefficient: ±200ppm/℃; Number of Pins: 8; Design Item ID: 22,1/16W,5%,8P4R; Library Name: *
TP3 = 1X4P_2.54F
U2 U5 U7 = RT9080N-08GJ5: Design Item ID: RT9080N; Library Name: SCM_START_402F
U6 = AT32F403CGT6: Design Item ID: LQFP48&amp;QFN48; Library Name: AT403-ALL-Package
J1 J2 = Header 12X2: 双排直插排针2*12P 2.54mm(黑色); LatestRevisionDate: 17-Jul-2002; LatestRevisionNote: Re-released for DXP Platform.; Publisher: Altium Limited; Library Name: Miscellaneous Connectors
J3 = CON10: 单排直插排母1*10P 2.54mm(黄色); Design Item ID: CON10_0; Library Name: *
J4 J5 = CON8: 单排直插排母1*8P 2.54mm(黄色); Library Name: *
J6 = CON6: 单排直插排母1*6P 2.54mm(黄色); Library Name: *
J7 = Header 4X2: 双排直插针2*4P 2.54mm(黄色); LatestRevisionDate: 17-Jul-2002; LatestRevisionNote: Re-released for DXP Platform.; Publisher: Altium Limited; Library Name: Miscellaneous Connectors
R24 R26 R28 = SB_PAD: 贴片电阻0R,1/10W,5%,0603; Design Item ID: 10K,1/10W,1%,SMD0603_Dup1; Library Name: *
R25 R27 R29 = 0603WAF0000T5E: 电阻类型:厚膜电阻;阻值:0Ω;精度:±1%;功率:100mW;最大工作电压:75V;; LCSC Part Name: 0Ω ±1% 100mW 厚膜电阻; Supplier Part: C21189; Manufacturer: UNI-ROYAL(厚声); Supplier Footprint: 0603; JLCPCB Part Class: Basic Part; Datasheet: https://atta.szlcsc.com/upload/public/pdf/source/20200306/C422600_1E6D84923E4A46A82E41ADD87F860B5C.pdf; Supplier: LCSC; Type: 厚膜电阻; Tolerance: ±1%; Power(Watts): 100mW; Overload Voltage (Max): 75V; Operating Temperature Range: -55℃~+155℃; Design Item ID: 10K,1/10W,1%,SMD0603_Dup1; Library Name: *
B1 = TS-1002S-05026C: 电路结构:单刀单掷;按钮形状:圆形按钮;安装方式:立贴;开关长度:6mm;开关宽度:6mm;开关高度:5mm;触点电流:50mA;额定电压(DC):12V;带灯:-;机械寿命:-;; LCSC Part Name: 6*6*5mm 立贴 轻触开关; Supplier Part: C455110; Manufacturer: XUNPU(讯普); Supplier Footprint: SMD,6x6mm; JLCPCB Part Class: Extended Part; Datasheet: https://atta.szlcsc.com/upload/public/pdf/source/20191118/C455126_F61E8FA1ED640FB1CE0B30B55DEB62E3.pdf; Supplier: LCSC; Circuit: 单刀单掷; Actuator Style: 圆形按钮; Mounting Style: 立贴; Switch Length: 6mm; Switch Width: 6mm; Switch Height: 5mm; Contact Current: 50mA; Voltage Rating (DC): 12V; Design Item ID: Push_Bottom,Blue,SMD_2P; Library Name: *
C1 C2 = CL10C180JB8NNNC: 容值:18pF;精度:±5%;额定电压:50V;材质(温度系数):C0G;; LCSC Part Name: 18pF ±5% 50V; Supplier Part: C1647; Manufacturer: SAMSUNG(三星); Supplier Footprint: 0603; JLCPCB Part Class: Basic Part; Datasheet: https://atta.szlcsc.com/upload/public/pdf/source/20160218/1457707763339.pdf; Supplier: LCSC; Tolerance: ±5%; Voltage Rated: 50V; Temperature Coefficient: C0G; Design Item ID: 10pF,50V,5%,SMD0603; Library Name: *
C3 C4 = CL10C150JB8NNNC: 容值:15pF;精度:±5%;额定电压:50V;材质(温度系数):C0G;; LCSC Part Name: 15pF ±5% 50V; Supplier Part: C1644; Manufacturer: SAMSUNG(三星); Supplier Footprint: 0603; JLCPCB Part Class: Basic Part; Datasheet: https://atta.szlcsc.com/upload/public/pdf/source/20160218/1457707763339.pdf; Supplier: LCSC; Tolerance: ±5%; Voltage Rated: 50V; Temperature Coefficient: C0G; Design Item ID: 10pF,50V,5%,SMD0603; Library Name: *
C6 = CL10A475KO8NNNC: 容值:4.7uF;精度:±10%;额定电压:16V;材质(温度系数):X5R;; LCSC Part Name: 4.7uF ±10% 16V; Supplier Part: C19666; Manufacturer: SAMSUNG(三星); Supplier Footprint: 0603; JLCPCB Part Class: Basic Part; Datasheet: https://atta.szlcsc.com/upload/public/pdf/source/20160218/1457707763339.pdf; Supplier: LCSC; Tolerance: ±10%; Voltage Rated: 16V; Temperature Coefficient: X5R; Design Item ID: 0.1uF,25V,20%,SMD0402; Library Name: *
C7 = CC0603KRX7R9BB104: 容值:100nF;精度:±10%;额定电压:50V;材质(温度系数):X7R;; LCSC Part Name: 100nF ±10% 50V; Supplier Part: C14663; Manufacturer: YAGEO(国巨); Supplier Footprint: 0603; JLCPCB Part Class: Basic Part; Datasheet: https://atta.szlcsc.com/upload/public/pdf/source/20180910/C282072_33301C7F631E79921B82A8DAC6BCC5B3.pdf; Supplier: LCSC; Tolerance: ±10%; Voltage Rated: 50V; Temperature Coefficient: X7R; Design Item ID: 0.1uF,25V,20%,SMD0402; Library Name: *
JP1 = 2.54-1*3P针: 插针结构:1x3P;间距:2.54mm;行距:-;圆针/方针:方针;安装类型:直插;排数:单排;总PIN位数:3P;额定电流:3A;额定电压:-;配合针长度:-;塑高:-;端接针长度:-;触头材质:-;触头镀层:-;工作温度范围:-40℃~+105℃;颜色:黑色;; LCSC Part Name: 间距:2.54mm 1x3P 直插 方针; Supplier Part: C49257; Manufacturer: BOOMELE(博穆精密); Supplier Footprint: 插件,P=2.54mm; JLCPCB Part Class: Extended Part; Datasheet: https://atta.szlcsc.com/upload/public/pdf/source/20221018/3E9408392E35E6F57A28985E5F7BF5C9.pdf; Supplier: LCSC; Pin Structure: 1x3P; Pitch: 2.54mm; Circluar Pins/Square Pins: 方针; Mounting Type: 直插; Number of Rows: 单排; Number of Pins: 3P; Current Rating (Max): 3A; Operating Temperature Range: -40℃~+105℃; Color: 黑色
R5 R6 R9 R10 = 0603WAF0000T5E: 电阻类型:厚膜电阻;阻值:0Ω;精度:±1%;功率:100mW;最大工作电压:75V;; LCSC Part Name: 0Ω ±1% 100mW 厚膜电阻; Supplier Part: C21189; Manufacturer: UNI-ROYAL(厚声); Supplier Footprint: 0603; JLCPCB Part Class: Basic Part; Datasheet: https://atta.szlcsc.com/upload/public/pdf/source/20200306/C422600_1E6D84923E4A46A82E41ADD87F860B5C.pdf; Supplier: LCSC; Type: 厚膜电阻; Tolerance: ±1%; Power(Watts): 100mW; Overload Voltage (Max): 75V; Operating Temperature Range: -55℃~+155℃; Design Item ID: 0,1/10W,1%,SMD0603; Library Name: *
R7 R8 R11 R12 = SB_PAD: 贴片电阻0R,1/10W,5%,0603; Design Item ID: 0,1/10W,1%,SMD0603; Library Name: *
R17 = 0603WAF3301T5E: 电阻类型:厚膜电阻;阻值:3.3kΩ;精度:±1%;功率:100mW;最大工作电压:75V;温度系数:±100ppm/℃;; LCSC Part Name: 3.3kΩ ±1% 100mW 厚膜电阻; Supplier Part: C22978; Manufacturer: UNI-ROYAL(厚声); Supplier Footprint: 0603; JLCPCB Part Class: Basic Part; Datasheet: https://atta.szlcsc.com/upload/public/pdf/source/20200306/C422600_1E6D84923E4A46A82E41ADD87F860B5C.pdf; Supplier: LCSC; Type: 厚膜电阻; Tolerance: ±1%; Power(Watts): 100mW; Overload Voltage (Max): 75V; Temperature Coefficient: ±100ppm/℃; Operating Temperature Range: -55℃~+155℃; Design Item ID: 10K,1/10W,1%,SMD0603; Library Name: *
U8 = AT32M412CxT7: 由官方提供; Manufacturer: ArteryTechnology
Y1 = 32.768KHz: 32.768KHz贴片晶振 TZ2528C 2012 12.5pf 20ppm; Design Item ID: 32.768KHz,CRY,30PPM,Size_3X8; Library Name: *
Y2 = CJ13-080001210B20: 频率:8MHz;常温频差:±10ppm;外接负载电容:12pF;; LCSC Part Name: 8MHz ±10ppm 12pF; Supplier Part: C2875274; Manufacturer: CJ(江苏长电/长晶); Supplier Footprint: SMD3225-4P; JLCPCB Part Class: Extended Part; Datasheet: https://atta.szlcsc.com/upload/public/pdf/source/20210824/6E1F59D92CEEC2B7E10E0FA064B9C05B.pdf; Supplier: LCSC; Normal temperature Frequency Tolerance: ±10ppm; External load capacitor: 12pF; Crystal Type: 贴片晶振; Frequency Stability(Full temperature range): ±30ppm; Equivalent Series Resistance (ESR): 100Ω; Operating Temperature: -40℃~+85℃; Design Item ID: SMD-5032_4P  8MHZ 20PF 10PPM; Library Name: Artery_Wanbing; ComponentLink1Description: 供应商链接; ComponentLink1URL: http://www.szlcsc.com/product/details_9522.html; SuppliersPartNumber: C9002
B2 = TSA063G60-250: 电路结构:单刀单掷;按钮形状:圆形按钮;作用力:250gf;安装方式:立贴;开关长度:6.1mm;开关宽度:6.1mm;开关高度:6mm;带支架:不带;触点电流:50mA;额定电压(DC):12V;绝缘电阻:100MΩ;带灯:无;机械寿命:5万次;; LCSC Part Name: 6.1*6.1*6mm 立贴 轻触开关; Supplier Part: C294566; Manufacturer: BRIGHT(博瑞泰); Supplier Footprint: SMD; JLCPCB Part Class: Extended Part; Datasheet: https://atta.szlcsc.com/upload/public/pdf/source/20181029/C294570_15EFF1F4D215547575AD6307D8A439BB.pdf; Supplier: LCSC; Circuit: 单刀单掷; Actuator Style: 圆形按钮; Operating Force: 250gf; Mounting Style: 立贴; Switch Length: 6.1mm; Switch Width: 6.1mm; Switch Height: 6mm; Strike Gundam: 不带; Contact Current: 50mA; Voltage Rating (DC): 12V; Insulation Resistance: 100MΩ; Actuator/Cap Color: 黑色; With Lamp: 无; Pin Style: 鸥翼型; Mechanical Life: 5万次; Operating Temperature: -25℃~+70℃; Design Item ID: Push_Bottom,Blue,SMD_2P; Library Name: *
C23 C25 = CL10A106KP8NNNC: 容值:10uF;精度:±10%;额定电压:10V;材质(温度系数):X5R;; LCSC Part Name: 10uF ±10% 10V; Supplier Part: C19702; Manufacturer: SAMSUNG(三星); Supplier Footprint: 0603; JLCPCB Part Class: Basic Part; Datasheet: https://atta.szlcsc.com/upload/public/pdf/source/20160218/1457707763339.pdf; Supplier: LCSC; Tolerance: ±10%; Voltage Rated: 10V; Temperature Coefficient: X5R
C24 C26 = CC0603KRX7R9BB104: 容值:100nF;精度:±10%;额定电压:50V;材质(温度系数):X7R;; LCSC Part Name: 100nF ±10% 50V; Supplier Part: C14663; Manufacturer: YAGEO(国巨); Supplier Footprint: 0603; JLCPCB Part Class: Basic Part; Datasheet: https://atta.szlcsc.com/upload/public/pdf/source/20180910/C282072_33301C7F631E79921B82A8DAC6BCC5B3.pdf; Supplier: LCSC; Tolerance: ±10%; Voltage Rated: 50V; Temperature Coefficient: X7R
CN2 = CON10: 简易牛角DC3-10P 双排直插针 2.54mm 2*5P双排 黑色; Design Item ID: CON10A_0; Library Name: *
J8 = PZ2.54-1*4-WZ: 插针结构:1x4P;间距:2.54mm;安装类型:弯插;排数:单排;总PIN位数:4P;触头镀层:金;; Supplier Part: C5224015; Manufacturer: ZHOURI(洲日); Supplier Footprint: 弯插,P=2.54mm; JLCPCB Part Class: Extended Part; Datasheet: https://atta.szlcsc.com/upload/public/pdf/source/20221031/5E07F614DEAC37F80EB82945E6A3298C.pdf; Supplier: LCSC; Pin Structure: 1x4P; Pitch: 2.54mm; Mounting Type: 弯插; Number of Rows: 单排; Number of Pins: 4P; Contact Plating: 金; Design Item ID: Header 4; Library Name: Miscellaneous Connectors; LatestRevisionDate: 17-Jul-2002; LatestRevisionNote: Re-released for DXP Platform.; Publisher: Altium Limited
JP3 = 1X2P_2.54M: Origin Footprint 2: SIP_2P; Design Item ID: 1X2P,Male,DIP_2.54; Library Name: *; Check: true
R3 R21-R23 = 0603WAF1001T5E: 电阻类型:厚膜电阻;阻值:1kΩ;精度:±1%;功率:100mW;最大工作电压:75V;温度系数:±100ppm/℃;; LCSC Part Name: 1kΩ ±1% 100mW 厚膜电阻; Supplier Part: C21190; Manufacturer: UNI-ROYAL(厚声); Supplier Footprint: 0603; JLCPCB Part Class: Basic Part; Datasheet: https://atta.szlcsc.com/upload/public/pdf/source/20200306/C422600_1E6D84923E4A46A82E41ADD87F860B5C.pdf; Supplier: LCSC; Type: 厚膜电阻; Tolerance: ±1%; Power(Watts): 100mW; Overload Voltage (Max): 75V; Temperature Coefficient: ±100ppm/℃; Operating Temperature Range: -55℃~+155℃; Design Item ID: 470,1/10W,1%,SMD0603; Library Name: *
R13 R18 = 0603WAF0000T5E: 电阻类型:厚膜电阻;阻值:0Ω;精度:±1%;功率:100mW;最大工作电压:75V;; LCSC Part Name: 0Ω ±1% 100mW 厚膜电阻; Supplier Part: C21189; Manufacturer: UNI-ROYAL(厚声); Supplier Footprint: 0603; JLCPCB Part Class: Basic Part; Datasheet: https://atta.szlcsc.com/upload/public/pdf/source/20200306/C422600_1E6D84923E4A46A82E41ADD87F860B5C.pdf; Supplier: LCSC; Type: 厚膜电阻; Tolerance: ±1%; Power(Watts): 100mW; Overload Voltage (Max): 75V; Operating Temperature Range: -55℃~+155℃; Design Item ID: 470,1/10W,1%,SMD0603; Library Name: *
R14-R16 = 0603WAF4700T5E: 电阻类型:厚膜电阻;阻值:470Ω;精度:±1%;功率:100mW;最大工作电压:75V;温度系数:±100ppm/℃;; LCSC Part Name: 470Ω ±1% 100mW 厚膜电阻; Supplier Part: C23179; Manufacturer: UNI-ROYAL(厚声); Supplier Footprint: 0603; JLCPCB Part Class: Basic Part; Datasheet: https://atta.szlcsc.com/upload/public/pdf/source/20200306/C422600_1E6D84923E4A46A82E41ADD87F860B5C.pdf; Supplier: LCSC; Type: 厚膜电阻; Tolerance: ±1%; Power(Watts): 100mW; Overload Voltage (Max): 75V; Temperature Coefficient: ±100ppm/℃; Operating Temperature Range: -55℃~+155℃
R19 = SB_PAD: 贴片电阻0R,1/10W,5%,0603; Design Item ID: 470,1/10W,1%,SMD0603; Library Name: *
R20 = 0603WAF1003T5E: 电阻类型:厚膜电阻;阻值:100kΩ;精度:±1%;功率:100mW;最大工作电压:75V;温度系数:±100ppm/℃;; LCSC Part Name: 100kΩ ±1% 100mW 厚膜电阻; Supplier Part: C25803; Manufacturer: UNI-ROYAL(厚声); Supplier Footprint: 0603; JLCPCB Part Class: Basic Part; Datasheet: https://atta.szlcsc.com/upload/public/pdf/source/20200306/C422600_1E6D84923E4A46A82E41ADD87F860B5C.pdf; Supplier: LCSC; Type: 厚膜电阻; Tolerance: ±1%; Power(Watts): 100mW; Overload Voltage (Max): 75V; Temperature Coefficient: ±100ppm/℃; Operating Temperature Range: -55℃~+155℃; Design Item ID: 10K,1/10W,1%,SMD0603; Library Name: *
T1 T2 = Test point: Keystone 美标塑料PCB板测试针环 黑色中号（TP-5006）; LatestRevisionDate: 17-Jul-2002; LatestRevisionNote: Re-released for DXP Platform.; Publisher: Altium Limited; Design Item ID: Socket; Library Name: Miscellaneous Connectors

## Nets
3V3: CN2.1 CN7.1 D2.1 D4.1(C) D5.1 J4.2 J4.4 J8.1 JP3.1 R3.2 R13.2 R21.2 R22.2 R23.2
GND: B1.3 B1.4 C1.1 C2.1 C3.1 C4.1 C5.1 C6.1 C7.1 C8.1 C9.1 C10.1 C11.1 C12.1 C14.1 C15.1 C16.1 C17.1 C18.1 C19.1 C20.1 C22.1 C23.2 C24.2 C25.2 C26.2 CN2.9 CN6.A1B12(GND) CN6.B1A12(GND) CN7.9 D4.2(A) J1.23 J3.7 J4.6 J4.7 J7.6 J8.4 JP1.3 LED1.2(CATHODE) P1.5 R2.2 R20.2 R34.2 R35.2 R36.2 R49.2 R51.2 T1.1 T2.1 TP3.4 U2.2(GND) U5.2(GND) U6.8(VSSA) U6.20(PB2) U6.23(VSS_1) U6.35(VSS_2) U6.39(PB3) U6.40(PB4) U6.47(VSS_3) U7.2(GND) U8.47(VSS/VSSA) Y2.2(GND) Y2.4(GND)
VCC: C8.2 C9.2 C10.2 C11.2 C12.2 C14.2 J9.1 P1.1 R43.1 RP1.1 RP1.2 RP1.3 RP1.4 U6.1(VBAT) U6.9(VDDA) U6.24(VDD_1) U6.36(VDD_2) U6.48(VDD_3) U7.5(OUT)
VCC3.5V: C17.2 D5.2 R50.1 U5.5(OUT)
VDD: B2.3 B2.4 C6.2 C7.2 J1.24 J3.8 JP1.1 JP3.2 R13.1 U8.48(VDD/VDDA)
ATLINK_5V: CN6.A4B9(VBUS) CN6.B4A9(VBUS) D3.2 F2.1 TP3.1
ATLK_BOOT0: R45.1 U6.27(PB14)
ATLK_NRST: R46.1 U6.28(PB15)
ATLK_RX: CN2.10 CN7.10 R16.2 R48.2
ATLK_SWCLK: R41.1 U6.25(PB12)
ATLK_SWDIO: R44.1 U6.26(PB13)
ATLK_SWO: R52.1 U6.13(PA3)
ATLK_TX: CN2.8 CN7.8 R15.2 R47.2
CC1: CN6.A5(CC1) R35.1
CC2: CN6.B5(CC2) R36.1
E5V: C23.1 C24.1 CN2.2 CN7.2 D3.1 J4.5 J7.2 U2.1(IN) U2.3(EN)
EGND: C20.2 CN6.13(GND) CN6.14(GND) CN6.15(GND) CN6.16(GND) R34.1
LD1: LD1.2(CATHODE) U6.10(PA0/WKUP)
LD2: LD2.2(CATHODE) U6.11(PA1)
LD3: LD3.2(CATHODE) U6.12(PA2)
LD4: LD4.2(CATHODE) U6.19(PB1)
M-ATLK_RX: R48.1 U6.31(PA10)
M-ATLK_TX: R47.1 U6.30(PA9)
M-BOOT0: J9.2 U6.44(BOOT0)
M-NRST: C22.2 P1.4 U6.7(NRST)
M-SWCLK: P1.3 U6.37(PA14)
M-SWDIO: P1.2 U6.34(PA13)
M-USB_DM: R38.2 U6.32(PA11)
M-USB_DP: R37.2 U6.33(PA12)
NRST/PF2: B1.1 B1.2 C5.2 CN2.7 CN7.7 J2.7 J4.3 J7.5 R46.2 U8.7(PF2/NRST)
PA0: J2.10 J6.1 R18.1 U8.10(PA0)
PA1: J2.11 J6.2 U8.11(PA1)
PA2: J2.12 J5.2 U8.12(PA2)
PA3: J2.13 J5.1 U8.13(PA3)
PA4: J2.14 J6.3 U8.14(PA4)
PA5: J2.15 J3.6 U8.15(PA5)
PA6: J2.16 J3.5 R25.1 U8.16(PA6)
PA7: J2.17 J3.4 U8.17(PA7)
PA8: J1.5 J5.7 U8.29(PA8)
PA9/USART1_TX: J1.6 J3.1 J8.2 R16.1 U8.30(PA9)
PA10/USART1_RX: J1.7 J5.3 J8.3 R15.1 U8.31(PA10)
PA11: J1.8 U8.32(PA11)
PA12: J1.9 U8.33(PA12)
PA13/SWDIO: CN2.3 CN7.3 J1.10 R44.2 U8.34(PA13)
PA14/SWCLK: CN2.5 CN7.5 J1.13 R41.2 U8.37(PA14)
PA15: J1.14 R29.1 U8.38(PA15)
PB0: J2.18 J6.4 U8.18(PB0)
PB1: J2.19 R27.1 U8.19(PB1)
PB2: J2.20 U8.20(PB2)
PB3/SWO: J1.15 J5.5 R14.1 U8.39(PB3)
PB4: J1.16 J5.6 U8.40(PB4)
PB5: J1.17 J5.4 U8.41(PB5)
PB6: J1.18 R28.1 U8.42(PB6)
PB7: J1.19 J3.2 U8.43(PB7)
PB8: J1.21 J3.10 R26.1 U8.45(PB8)
PB9: J1.22 J3.9 R24.1 U8.46(PB9)
PB10: J2.21 J5.8 U8.21(PB10)
PB11: J2.22 J7.8 U8.22(PB11)
PB12: J1.1 J7.7 U8.25(PB12)
PB13: J1.2 J7.3 U8.26(PB13)
PB14: J1.3 J7.1 U8.27(PB14)
PB15: J1.4 J7.4 U8.28(PB15)
PC13: J2.2 R19.1 U8.2(PC13)
PC14: J2.3 R7.1
PC15: J2.4 R8.1
PF0: J2.5 R11.1
PF1: J2.6 R12.1
PF6: J1.11 LED2.2(CATHODE) U8.35(PF6)
PF7: J1.12 LED3.2(CATHODE) U8.36(PF7)
PF8: J2.1 LED4.2(CATHODE) U8.1(PF8)
PF9: J2.8 U8.8(PF9)
PF10: J2.9 U8.9(PF10)
PF11/BOOT0: CN2.4 CN7.4 J1.20 R17.1 R45.2 U8.44(PF11/BOOT0)
PF12: J2.23 U8.23(PF12)
PF13: J2.24 U8.24(PF13)
SWO: CN2.6 CN7.6 R14.2 R52.2
USBM: CN6.A7(DN1) CN6.B7(DN2) R38.1 TP3.2
USBP: CN6.A6(DP1) CN6.B6(DP2) R37.1 TP3.3
$1N792: LD1.1(ANODE) RP1.8
$1N793: LD2.1(ANODE) RP1.7
$1N794: LD3.1(ANODE) RP1.6
$1N795: LD4.1(ANODE) RP1.5
$1N16959: C15.2 C16.2 C18.2 C19.2 F2.2 U5.1(IN) U5.3(EN) U7.1(IN) U7.3(EN)
$1N17598: R43.2 R49.1 U7.4(SNS)
$1N17675: R50.2 R51.1 U5.4(SNS)
$2N438: C2.2 R6.1 Y1.2
$2N5937: R9.2 R11.2 U8.5(PF0/HEXT_IN)
$2N5955: R10.2 R12.2 U8.6(PF1/HEXT_OUT)
$2N5975: C1.2 R5.1 Y1.1
$2N6104: R5.2 R7.2 U8.3(PC14)
$2N6111: R6.2 R8.2 U8.4(PC15)
$2N6210: C3.2 R9.1 Y2.3
$2N6248: C4.2 R10.1 Y2.1
$2N7510: JP1.2 R17.2
$3N526: LED1.1(ANODE) R3.1
$3N6624: C25.1 C26.1 D2.2 R1.1 U2.5(OUT)
$3N6989: LED2.1(ANODE) R21.1
$3N7005: LED3.1(ANODE) R22.1
$3N7010: LED4.1(ANODE) R23.1
$3N7265: R1.2 R2.1 U2.4(SNS)
$3N7356: B2.1 B2.2 R18.2 R19.2 R20.1
$4N2984: J6.5 R24.2 R25.2
$4N3391: J6.6 R26.2 R27.2
$4N3469: J3.3 R28.2 R29.2

Not connected (* = marked no-connect by the designer): CN6 A8(SBU1)* B8(SBU2)*; J4 1* 8*; U6 2(PC13/TAMPER_RTC)* 3(PC14/LEXT_IN)* 4(PC15/LEXT_OUT)* 5(PD0/HEXT_IN)* 6(PD1/HEXT_OUT)* 14(PA4)* 15(PA5)* 16(PA6)* 17(PA7)* 18(PB0)* 21(PB10)* 22(PB11)* 29(PA8)* 38(PA15)* 41(PB5)* 42(PB6)* 43(PB7)* 45(PB8)* 46(PB9)*

## Notes on the sheets
sheet 1
- Close to slot
- For Test
- AT-Link USB
- AT-Link power supply
- AT-Link EZ CN7 to AT-START CN2 connection
- LD1-4:For AT-Link-EZ status
- AT-START-M412
- AT-Link
- 2024-08-05
sheet 2
- AT32M412CBT7
- AT-START-M412
- MCU
- 2024-08-05
sheet 3
- Default:R13 ON
- JP3 for MCU current measurement
- Power
- AT-Link interface
- User key
- USART1 for ISP
- AT-START-M412
- LEDs
- Test points
- 2024-08-05
sheet 4
- Arduino UNO R3 connectors
- SCL
- SDA
- D13
- IOREF
- D12
- D11
- D10
- D8
- D9
- MCU
- D7
- AN0
- D5
- D6
- AN1
- D4
- AN2
- D3
- AN3
- D2
- AN4
- D1
- AN5
- D0
- SCK
- MISO
- CS
- MOSI
- AT-START-M412
- Extension connectors
- 2024-08-05
